# EasyEDA Pro project ProDocument_BFMC_IMU.pcb_V3.epro

# Board IMU_Final_PCB
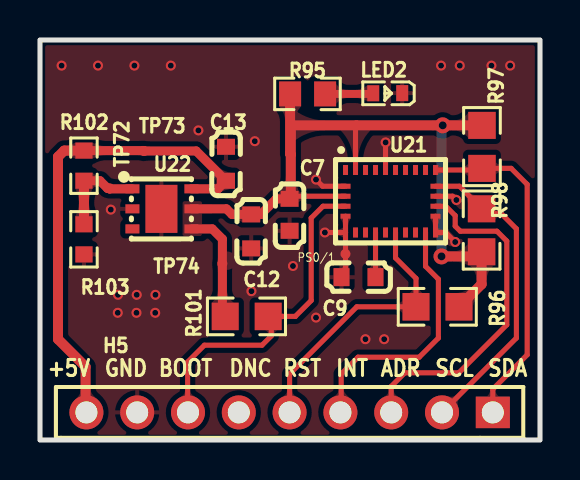
[diagram p0: board, top side]
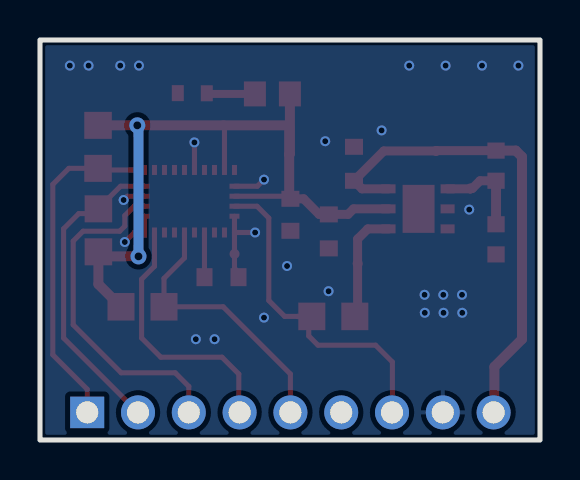
[diagram p1: board, bottom side, seen from below]

Outline 25 x 20 mm; copper layers: Top Layer, Bottom Layer. Coordinates in mm from the lower left corner of the outline.
Outline path: rectangle 0,20 25,0
Stack: Top Layer 0.035mm / Dielectric1 1.51mm FR4 er 4.5 / Bottom Layer 0.035mm

## Design rules (mm)
template: JLCPCB Capability(Two Layers Board)
spacing copperThickness1oz (default): track to track 0.102, other pairs 0.152 to 0.3
spacing copperThickness2oz: track to track 0.203, other pairs 0.152 to 0.3
track width copperThickness1oz (default): min 0.127, default 0.254, max 2.54
track width copperThickness2oz: min 0.203, default 0.254, max 2.54
differential pair differentialPair (default): width min 0.127, default 0.254, max 2.54; gap min 0.152, default 0.152
via viaSize (default): diameter min 0.5, default 0.61, max 10; hole min 0.3, default 0.305, max 6.3

## Placement (name value [footprint] x y rotation side)
C7  100nF  [Cbst2]  12.48 11.16 90 top
C9  1uF  [C9]  15.88 8.14 0 top
C12  4.7uF  [C9]  10.56 10.38 90 top
C13  4.7uF  [C9]  9.3 13.86 270 top
H5  -  [HDR-TH_9P-P2.54-V-F-1]  12.48 1.38 180 top
LED2  TLMS1100-GS08  [LED2 RED]  17.46 17.34 180 top
PS0/1  -  [Test-Point-0.5mm]  15.27 9.3 0 top
R95  100  [Rtrip]  13.5 17.3 180 top
R96  10K  [0805 dany2]  19.8 6.66 0 top
R97  2.2k  [0805 dany2]  22.1 14.73 270 top
R98  2.2k  [0805 dany2]  22.08 10.56 270 top
R101  10K  [0805 dany2]  10.26 6.18 0 top
R102  10K  [R0603]  2.2 13.72 270 top
R103  10K  [R0603]  2.2 10.03 270 top
TP72  -  [Test-Point-0.5mm]  3.47 12.58 0 top
TP73  -  [Test-Point-0.5mm]  5.2 14.45 0 top
TP74  -  [Test-Point-0.5mm]  9.12 8.82 0 top
U21  BNO055  [LGA-28_L5.2-W3.8-P0.50-BL]  17.53 11.94 270 top
U22  NCP708MU330TAG  [DFN-6_L3.0-W3.0-P0.95-LS3.1-BL-EP]  6.1 11.56 270 top

## Footprints (pads in the part's own frame, mm; a bottom-side part is the same pattern mirrored in y, then rotated)
0805 dany2
  rect 1.35x1.377 smd: 1(-1,0) 2(1.15,0)
C9
  rect 0.8x0.9 smd: 1(-0.8,0) 2(0.9,0)
Cbst2
  rect 0.8x0.9 smd: 1(-0.7,0) 2(0.9,0)
DFN-6_L3.0-W3.0-P0.95-LS3.1-BL-EP
  rect 0.45x0.701 smd: 1(-1.001,-1.476) 2(0,-1.476) 3(1.001,-1.476) 4(1.001,1.476) 5(0,1.476) 6(-1.001,1.476)
  rect 2.4x1.6 smd: 7(0,-0.025)
HDR-TH_9P-P2.54-V-F-1
  rect 1.7x1.575 hole 1.1: 1(-10.16,0)
  round 1.7 hole 1.1: 2(-7.62,0) 3(-5.08,0) 4(-2.54,0) 5(0,0) 6(2.54,0) 7(5.08,0) 8(7.62,0) 9(10.16,0)
LED2 RED
  rect 0.6x0.8 smd: 1(-0.65,-0.004) 2(0.799,0.004)
LGA-28_L5.2-W3.8-P0.50-BL
  rect 0.5x0.25 smd: 1(-1.563,-2.25) 6(1.563,-2.25) 7(1.563,-1.75) 8(1.563,-1.25) 9(1.563,-0.75) 10(1.563,-0.25) 11(1.563,0.25) 12(1.563,0.75) 13(1.563,1.25) 14(1.563,1.75) 15(1.563,2.25) 20(-1.563,2.25) 21(-1.563,1.75) 22(-1.563,1.25) 23(-1.563,0.75) 24(-1.563,0.25) 25(-1.563,-0.25) 26(-1.563,-0.75) 27(-1.563,-1.25) 28(-1.563,-1.75)
  rect 0.25x0.5 smd: 2(-0.75,-2.25) 3(-0.25,-2.25) 4(0.25,-2.25) 5(0.75,-2.25) 16(0.75,2.25) 17(0.25,2.25) 18(-0.25,2.25) 19(-0.75,2.25)
R0603
  rect 0.806x0.864 smd: 1(-0.753,0) 2(0.753,0)
Rtrip
  rect 1.1x1.25 smd: 1(-0.753,0) 2(0.997,0)
Test-Point-0.5mm
  round 0.5 smd: 1(0,0)

## Nets
+5V: C13.2 H5.9 R102.1 TP73.1 U22.6
GND: C7.1 C9.1 C12.1 C13.1 H5.8 LED2.1 PS0/1.1 R103.2 U21.2 U21.5 U21.6 U21.15 U21.16 U21.18 U21.25 U22.2 U22.7
VDDIO: C7.2 C12.2 R95.2 R96.2 R97.1 R98.2 R101.1 TP74.1 U21.3 U21.28 U22.4 U22.5
BOOT: H5.7 R101.2 U21.4
EN3V3: R102.2 R103.1 TP72.1 U22.1
GPIO6: H5.5 R96.1 U21.11
I2C_ADRESS_SELECT: H5.3 U21.17
INT: H5.4 U21.14
SCK/SCL: H5.2 R98.1 U21.19
SDI/SDA: H5.1 R97.2 U21.20
$1N1002: C9.2 U21.9
$1N2238: LED2.2 R95.1

Pads without a net: H5 6; U21 1 7 8 10 12 13 21 22 23 24 26 27; U22 3

## Via types
v1: diameter 0.8, hole 0.4, Top Layer to Bottom Layer, 2 vias
v2: diameter 0.5, hole 0.3, Top Layer to Bottom Layer, 27 vias

## Routing (per net, layer and track width the routed paths; a pad name or vN(x,y) marks a point on that pad's centre or on a via; arc(x,y) is an arc through that point)
+5V: length 24.4
  Top Layer w0.45: R102.1 5.18,14.47 TP73.1 7.81,14.45 C13.2 8.9,12.56 U22.6
  Top Layer w0.5: H5.9 2.28,1.42 2.28,3.66 0.9,5.04 0.9,14.16 1.21,14.47 R102.1
GND: length 10
  Top Layer w0.254: v2(17.28,14.88) 17.28,14.88 U21.25 ; 15.07,8.38 15.28,8.58 U21.6 ; U21.6 v2(14.24,10.38) 14.24,10.38 ; U21.6 U21.5 ; U21.16 U21.15 20.28,10.38 v2(20.76,9.9) ; U21.2 14.13,12.69 v2(13.8,13.02) ; U21.18 20.63,12.19 v2(20.82,12)
  vias: v2(1.08,18.72) v2(2.9,18.72) v2(3.54,11.52) v2(3.9,7.26) v2(3.89,6.36) v2(4.72,18.72) v2(4.84,7.26) v2(4.82,6.36) v2(5.77,7.26) v2(5.76,6.36) v2(6.54,18.72) v2(7.92,15.48) v2(10.57,7.44) v2(10.74,14.94) v2(12.65,8.7) v2(13.8,6.12) v2(16.27,5.04) v2(17.21,5.04) v2(20.05,18.72) v2(20.99,18.72) v2(22.57,18.72) v2(23.51,18.72)
VDDIO: length 44.2
  Top Layer w0.254: U21.3 12.61,12.19 C7.2 ; U21.28 15.78,15.69 15.82,15.73
  Top Layer w0.45: U22.4 8.61,10.56 9.12,10.05 9.12,6.73 9.26,6.59 R101.1 ; U22.5 9.32,11.56 9.6,11.28 11.04,11.28 11.82,12.06 C7.2
  Top Layer w0.5: R95.2 12.5,14.32 12.54,14.28 ; R97.1 v1(20.14,15.73) 12.61,15.73 12.54,15.66 12.54,14.28 ; R96.2 22.08,7.79 R98.2 21.85,9.18 v1(20.08,9.18) ; 12.54,14.28 12.54,12.26 12.61,12.19
  Bottom Layer w0.5: v1(20.08,9.18) 20.08,15.67 v1(20.14,15.73)
BOOT: length 16.7
  Top Layer w0.254: 12.12,6.18 12.77,6.18 13.56,6.97 13.56,11.1 14.15,11.69 U21.4 ; 12.12,6.18 11.56,6.18 11.56,5.2 11.1,4.74 8.22,4.74 7.38,3.9 7.38,1.4 H5.7 ; 12.12,6.18 12.13,6.17
EN3V3: length 4.8
  Top Layer w0.45: 3.49,12.56 U22.1 ; 3.49,12.56 TP72.1 3.38,12.58 3,12.96 R102.2 ; 3.49,12.56 3.47,12.56
  Top Layer w0.5: R102.2 R103.1
GPIO6: length 13.8
  Top Layer w0.254: U21.11 17.78,9.1 18.8,8.08 R96.1 15.84,6.66 12.48,3.3 H5.5
I2C_ADRESS_SELECT: length 17.1
  Top Layer w0.254: U21.17 20.29,11.69 20.76,11.22 20.76,10.69 21.01,10.44 22.85,10.44 23.34,9.95 23.34,5.76 20.94,3.36 18.24,3.36 17.56,2.68 H5.3
INT: length 12.9
  Top Layer w0.254: 15.02,1.52 15.06,1.56 15.06,3.3 15.9,4.14 18.96,4.14 19.92,5.1 19.92,8.04 19.28,8.68 U21.14
SCK/SCL: length 15.6
  Top Layer w0.254: U21.19 20.97,12.69 22.34,11.32 23.06,11.32 23.82,10.56 23.82,5.1 H5.2
SDI/SDA: length 17.1
  Top Layer w0.254: U21.20 22.02,13.5 R97.2 23.56,13.58 24.36,12.78 24.36,4.26 22.64,2.54 H5.1
$1N1002: length 2.2
  Top Layer w0.254: U21.9 16.78,8.14
$1N2238: length 2.4
  Top Layer w0.4: R95.1 16.57,17.3 16.6,17.34 LED2.2

## Copper pours and planes (outline as drawn; the poured copper is in the pictures)
GND on Top Layer: -1.74,21.06 26.04,21.06 26.04,-1.56 -1.74,-1.56
GND on Bottom Layer: -2.04,21.3 27.84,21.3 27.84,-0.72 -2.04,-0.72
VDDIO on Top Layer: 7.08,11.94 8.1,11.94 8.1,10.2 7.08,10.2

Small or netless copper shapes (teardrops, artwork), in the pictures only: 62 on Top Layer, 2 on Bottom Layer

## Text on the board
Top Silkscreen Layer: +5V | GND | BOOT | DNC | RST | INT | ADR | SCL | SDA
